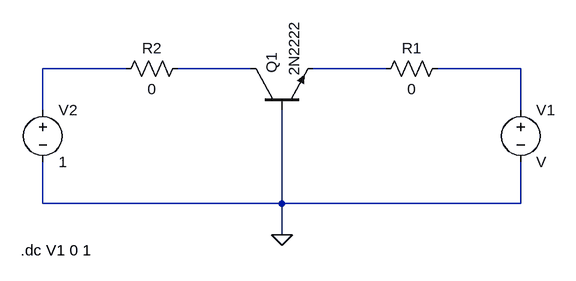
[diagram p0: schematic exp7.asc]
exp7.asc, the LTspice schematic file:
Version 4
SHEET 1 880 680
WIRE 64 160 -64 160
WIRE 256 160 144 160
WIRE 464 160 352 160
WIRE 672 160 544 160
WIRE -64 224 -64 160
WIRE 672 224 672 160
WIRE -64 368 -64 304
WIRE 304 368 304 224
WIRE 304 368 -64 368
WIRE 672 368 672 304
WIRE 672 368 304 368
WIRE 304 416 304 368
FLAG 304 416 0
SYMBOL npn 256 224 R270
WINDOW 3 53 67 Left 2
SYMATTR InstName Q1
SYMATTR Value 2N2222
SYMBOL voltage 672 208 R0
SYMATTR InstName V1
SYMBOL res 560 144 R90
WINDOW 0 0 56 VBottom 2
WINDOW 3 32 56 VTop 2
SYMATTR InstName R1
SYMATTR Value 0
SYMBOL res 160 144 R90
WINDOW 0 0 56 VBottom 2
WINDOW 3 32 56 VTop 2
SYMATTR InstName R2
SYMATTR Value 0
SYMBOL voltage -64 208 R0
SYMATTR InstName V2
SYMATTR Value 1
TEXT -98 440 Left 2 !.dc V1 0 1

The netlist it stands for:
* exp7.asc
Q1 N002 0 N003 0 2N2222
V1 N004 0 V
R1 N004 N003 0
R2 N002 N001 0
V2 N001 0 1
.model NPN NPN
.model PNP PNP
.lib standard.bjt
.dc V1 0 1
.backanno
.end